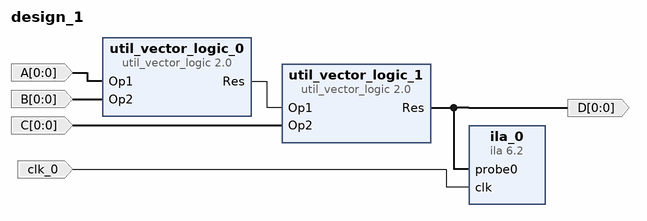
[diagram p0: block diagram of the top level]
# Vivado block design design_1, xc7a100tcsg324-1, Vivado 2022.2
create_bd_design design_1

create_bd_port -dir I -from 0 -to 0 C
create_bd_port -dir I -from 0 -to 0 A
create_bd_port -dir I -from 0 -to 0 B
create_bd_port -dir O -from 0 -to 0 D
create_bd_port -dir I -type clk clk_0

create_bd_cell -type ip -vlnv xilinx.com:ip:util_vector_logic:2.0 util_vector_logic_1
set_property -dict {CONFIG.C_OPERATION or CONFIG.C_SIZE 1} [get_bd_cells util_vector_logic_1]
create_bd_cell -type ip -vlnv xilinx.com:ip:util_vector_logic:2.0 util_vector_logic_0
set_property -dict {CONFIG.C_OPERATION and CONFIG.C_SIZE 1} [get_bd_cells util_vector_logic_0]
create_bd_cell -type ip -vlnv xilinx.com:ip:ila:6.2 ila_0
set_property -dict [list \
  CONFIG.ALL_PROBE_SAME_MU_CNT 2 \
  CONFIG.C_ADV_TRIGGER true \
  CONFIG.C_EN_STRG_QUAL 1 \
  CONFIG.C_MONITOR_TYPE Native \
] [get_bd_cells ila_0]

# ---- connections ----

connect_bd_net [get_bd_ports A] [get_bd_pins util_vector_logic_0/Op1]
connect_bd_net -net Op2_0_1 [get_bd_ports C] [get_bd_pins util_vector_logic_1/Op2]
connect_bd_net -net Op2_1_1 [get_bd_ports B] [get_bd_pins util_vector_logic_0/Op2]
connect_bd_net -net clk_0_1 [get_bd_ports clk_0] [get_bd_pins ila_0/clk]
connect_bd_net -net util_vector_logic_1_Res [get_bd_pins util_vector_logic_0/Res] [get_bd_pins util_vector_logic_1/Op1]
connect_bd_net [get_bd_pins util_vector_logic_1/Res] [get_bd_ports D] [get_bd_pins ila_0/probe0]

validate_bd_design
save_bd_design
